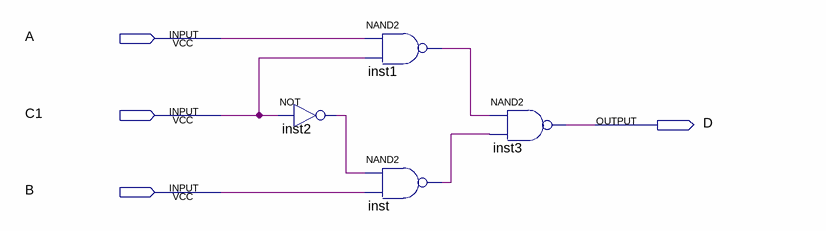
[diagram p0: schematic sheet]
// Quartus schematic multiplexor.bdf as structural Verilog: 4 symbols, 4 pins
module multiplexor (
  input  A,
  input  C1,
  input  B,
  output D
);

  wire inst1_out, inst2_out, inst_out;

  not inst2 (inst2_out, C1);
  nand inst1 (inst1_out, A, C1);
  nand inst (inst_out, inst2_out, B);
  nand inst3 (D, inst1_out, inst_out);
endmodule
